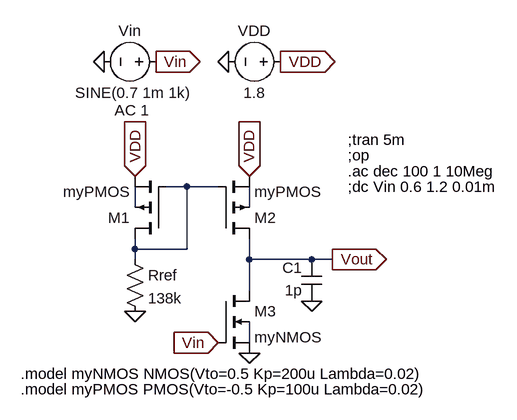
[diagram p0: schematic Simple_PMOS_Current_Mirror_Amplifier.asc]
Simple_PMOS_Current_Mirror_Amplifier.asc, the LTspice schematic file:
Version 4
SHEET 1 880 680
WIRE 208 -256 176 -256
WIRE 256 -256 208 -256
WIRE 128 -224 128 -256
WIRE 304 -224 304 -256
WIRE 128 -160 128 -176
WIRE 208 -160 208 -256
WIRE 208 -160 128 -160
WIRE 128 -144 128 -160
WIRE 304 -144 304 -176
WIRE 400 -144 304 -144
WIRE 432 -144 400 -144
WIRE 304 -96 304 -144
WIRE 304 -16 304 -48
FLAG 128 -64 0
FLAG 272 -448 0
FLAG 352 -448 VDD
IOPIN 352 -448 Out
FLAG 128 -272 VDD
IOPIN 128 -272 In
FLAG 304 -272 VDD
IOPIN 304 -272 In
FLAG 432 -144 Vout
IOPIN 432 -144 Out
FLAG 80 -448 0
FLAG 400 -80 0
FLAG 304 0 0
FLAG 160 -448 Vin
IOPIN 160 -448 Out
FLAG 256 -16 Vin
IOPIN 256 -16 In
SYMBOL res 112 -160 R0
SYMATTR InstName Rref
SYMATTR Value 138k
SYMBOL voltage 368 -448 R90
WINDOW 0 -32 56 VBottom 2
WINDOW 3 32 56 VTop 2
SYMATTR InstName VDD
SYMATTR Value 1.8
SYMBOL voltage 176 -448 R90
WINDOW 0 -32 56 VBottom 2
WINDOW 3 32 51 VTop 2
WINDOW 123 59 53 VTop 2
WINDOW 39 0 0 Left 0
SYMATTR InstName Vin
SYMATTR Value SINE(0.7 1m 1k)
SYMATTR Value2 AC 1
SYMBOL cap 416 -80 R180
WINDOW 0 30 51 Left 2
WINDOW 3 30 17 Left 2
SYMATTR InstName C1
SYMATTR Value 1p
SYMBOL pmos4 176 -176 R180
SYMATTR InstName M1
SYMATTR Value myPMOS
SYMATTR Value2 l=1u w=4u
SYMBOL pmos4 256 -176 M180
SYMATTR InstName M2
SYMATTR Value myPMOS
SYMATTR Value2 l=1u w=4u
SYMBOL nmos4 256 -96 R0
SYMATTR InstName M3
SYMATTR Value myNMOS
SYMATTR Value2 l=1u w=2u
TEXT 456 -328 Left 2 !;tran 5m
TEXT 456 -304 Left 2 !;op
TEXT 456 -256 Left 2 !;dc Vin 0.6 1.2 0.01m
TEXT 456 -280 Left 2 !.ac dec 100 1 10Meg
TEXT -48 32 Left 2 !.model myNMOS NMOS(Vto=0.5 Kp=200u Lambda=0.02)
TEXT -48 56 Left 2 !.model myPMOS PMOS(Vto=-0.5 Kp=100u Lambda=0.02)

The netlist it stands for:
* Simple_PMOS_Current_Mirror_Amplifier.asc
Rref N001 0 138k
VDD VDD 0 1.8
Vin Vin 0 SINE(0.7 1m 1k) AC 1
C1 0 Vout 1p
M1 N001 N001 VDD N002 myPMOS l=1u w=4u
M2 Vout N001 VDD N003 myPMOS l=1u w=4u
M3 Vout Vin 0 N004 myNMOS l=1u w=2u
.model NMOS NMOS
.model PMOS PMOS
.lib standard.mos
;tran 5m
;op
;dc Vin 0.6 1.2 0.01m
.ac dec 100 1 10Meg
.model myNMOS NMOS(Vto=0.5 Kp=200u Lambda=0.02)
.model myPMOS PMOS(Vto=-0.5 Kp=100u Lambda=0.02)
.backanno
.end